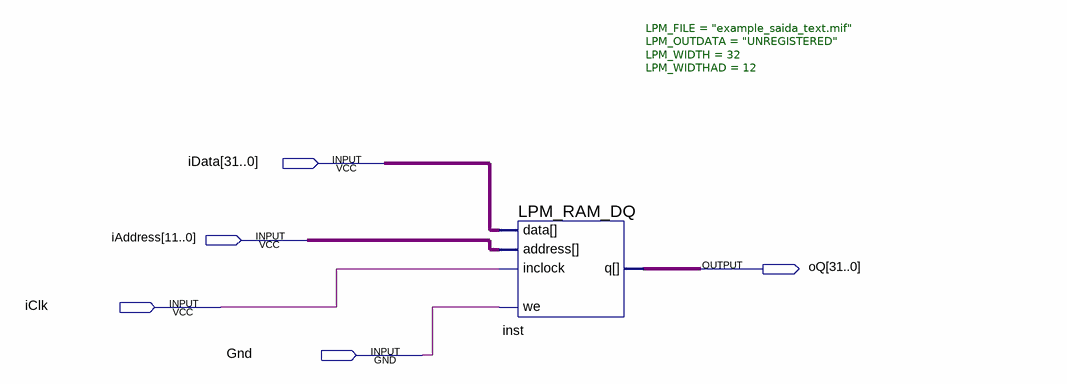
[diagram p0: schematic sheet]
// Quartus schematic ram2.bdf as structural Verilog: 1 symbols, 5 pins
module ram2 (
  input  [31:0] iData,
  input  [11:0] iAddress,
  input  iClk,
  input  Gnd,
  output [31:0] oQ
);

  LPM_RAM_DQ #(.LPM_FILE("example_saida_text.mif"), .LPM_OUTDATA("UNREGISTERED"), .LPM_WIDTH(32), .LPM_WIDTHAD(12)) inst (
    .address(iAddress), .data(iData), .inclock(iClk), .we(Gnd), .q(oQ));
endmodule
